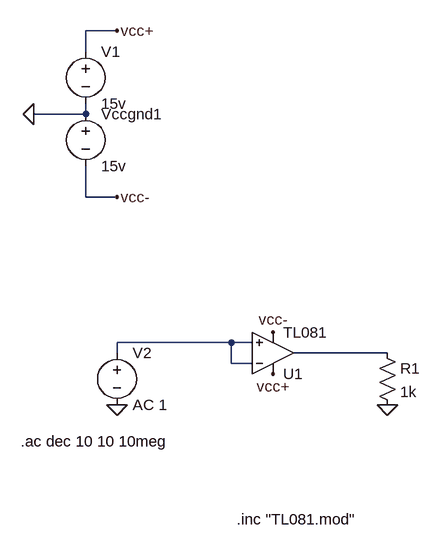
[diagram p0: schematic Draft2.asc]
Draft2.asc, the LTspice schematic file:
Version 4
SHEET 1 880 680
WIRE -48 -336 -96 -336
WIRE -96 -304 -96 -336
WIRE -96 -208 -96 -224
WIRE -96 -208 -176 -208
WIRE -96 -80 -96 -128
WIRE -48 -80 -96 -80
WIRE 128 144 -48 144
WIRE 160 144 128 144
WIRE -48 160 -48 144
WIRE 368 160 224 160
WIRE 128 176 128 144
WIRE 160 176 128 176
FLAG 192 128 vcc-
FLAG 192 192 vcc+
FLAG -48 -336 vcc+
FLAG -48 -80 vcc-
FLAG -176 -208 0
FLAG -48 240 0
FLAG 368 240 0
SYMBOL Opamps\\opamp2 192 224 M180
SYMATTR InstName U1
SYMATTR Value TL081
SYMBOL voltage -96 -320 R0
SYMATTR InstName V1
SYMATTR Value 15v
SYMBOL voltage -96 -224 R0
SYMATTR InstName Vccgnd1
SYMATTR Value 15v
SYMBOL voltage -48 144 R0
SYMATTR InstName V2
SYMATTR Value AC 1
SYMBOL res 352 144 R0
SYMATTR InstName R1
SYMATTR Value 1k
TEXT -196 296 Left 2 !.ac dec 10 10 10meg
TEXT 136 416 Left 2 !.inc "TL081.mod"

The netlist it stands for:
* Draft2.asc
XU1 N001 N001 vcc+ vcc- N002 TL081  ; pins In+ In- V+ V- OUT
V1 vcc+ 0 15v
Vccgnd1 0 vcc- 15v
V2 N001 0 AC 1
R1 N002 0 1k
.ac dec 10 10 10meg
.inc "TL081.mod"
.backanno
.end